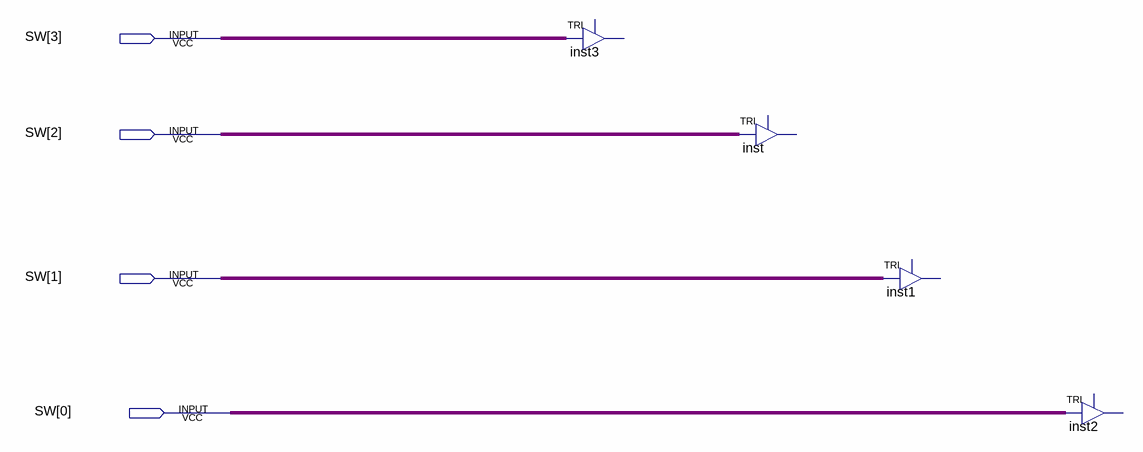
[diagram p0: schematic sheet]
// Quartus schematic schematic.bdf as structural Verilog: 4 symbols, 4 pins
module schematic (
  input  [3:0] SW
);

  TRI inst3 (.IN(SW[3]));  // open: OE, OUT
  TRI inst (.IN(SW[2]));  // open: OE, OUT
  TRI inst1 (.IN(SW[1]));  // open: OE, OUT
  TRI inst2 (.IN(SW[0]));  // open: OE, OUT
endmodule
